# Altium schematic sheet Alimentations.SchDoc
size A4
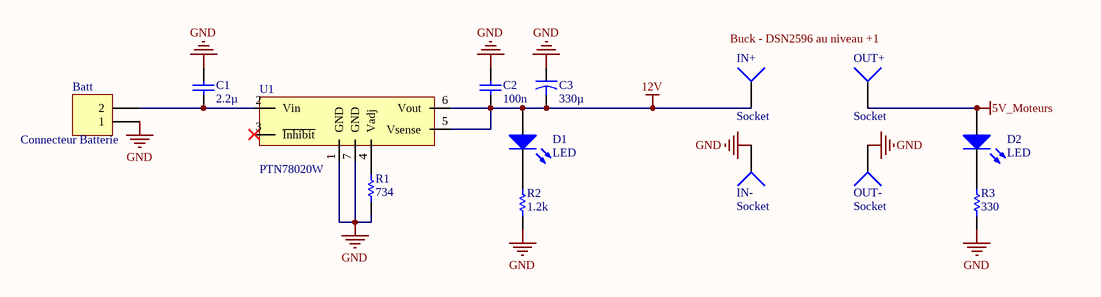
[diagram p0: Alimentations.SchDoc]

## Parts
Batt  Connecteur Batterie  [SHDR2W95P0X381_1X2_901X700X940P]
C1  value 2.2µ  [0805]  (hidden comment: Cap)
C2  value 100n  [0805]  (hidden comment: Cap)
C3  value 330µ  [CAPR5-4X5]  (hidden comment: Cap2)
D1  LED  [C0805]
D2  LED  [C0805]
IN+  Socket  [PIN1]
IN-  Socket  [PIN1]
OUT+  Socket  [PIN1]
OUT-  Socket  [PIN1]
R1  value 734  [0805]  (hidden comment: Res*)
R2  value 1.2k  [0805]  (hidden comment: Res*)
R3  value 330  [0805]  (hidden comment: Res*)
U1  PTN78020W  [PTN78020WAH]

## Nets
5V_Moteurs: D2.1(A) OUT+.1
12V: C2.1 C3.2 D1.1(A) IN+.1 U1.5(Vsense) U1.6(Vout)
GND: Batt.1 C1.2 C2.2 C3.1 IN-.1 OUT-.1 R1.1 R2.1 R3.2 U1.1(GND) U1.7(GND)
NetBatt_2: Batt.2 C1.1 U1.2(Vin)
NetD1_2: D1.2(K) R2.2
NetD2_2: D2.2(K) R3.1
NetR1_2: R1.2 U1.4(Vadj)

Not connected (* = marked no-connect by the designer): U1 3(~{Inhibit})*

## Notes on the sheet
- Labels drawn without touching a wire or pin: Buck - DSN2596 au niveau +1

## Library data of the parts
Batt = Header 2: Header, 2-Pin; LatestRevisionDate: 17-Jul-2002; LatestRevisionNote: Re-released for DXP Platform.; Publisher: Altium Limited
C1 = Cap: 2.2µ; Published: 8-Jun-2000; LatestRevisionDate: 17-Jul-2002; LatestRevisionNote: Re-released for DXP Platform.; PackageReference: RAD-0.3; Publisher: Altium Limited
C2 = Cap: 100n; Published: 8-Jun-2000; LatestRevisionDate: 17-Jul-2002; LatestRevisionNote: Re-released for DXP Platform.; PackageReference: RAD-0.3; Publisher: Altium Limited
C3 = Cap2: 330µ; Published: 23-Sep-2002; PackageReference: CAPR5-4X5; Publisher: Altium Limited
D1 = LED1: LED Bleu; Published: 8-Jun-2000; LatestRevisionDate: 08-Jul-2005; LatestRevisionNote: Mech Layer 1 removed.; PackageReference: LED-1; Publisher: Altium Limited
D2 = LED1: LED Verte; Published: 8-Jun-2000; LatestRevisionDate: 08-Jul-2005; LatestRevisionNote: Mech Layer 1 removed.; PackageReference: LED-1; Publisher: Altium Limited
R1 = Res1: 734R 1%; Published: 8-Jun-2000; LatestRevisionDate: 17-Jul-2002; LatestRevisionNote: Re-released for DXP Platform.; PackageReference: AXIAL-0.3; Publisher: Altium Limited
R2 = Res1: 1.2k; Published: 8-Jun-2000; LatestRevisionDate: 17-Jul-2002; LatestRevisionNote: Re-released for DXP Platform.; PackageReference: AXIAL-0.3; Publisher: Altium Limited
R3 = Res1: 330R; Published: 8-Jun-2000; LatestRevisionDate: 17-Jul-2002; LatestRevisionNote: Re-released for DXP Platform.; PackageReference: AXIAL-0.3; Publisher: Altium Limited
U1 = PTN78020W: Alim à découpage 6A
IN+ IN- OUT+ OUT- = Socket: LatestRevisionDate: 17-Jul-2002; LatestRevisionNote: Re-released for DXP Platform.; Publisher: Altium Limited